# Altium schematic sheet RTC.SchDoc
size A4
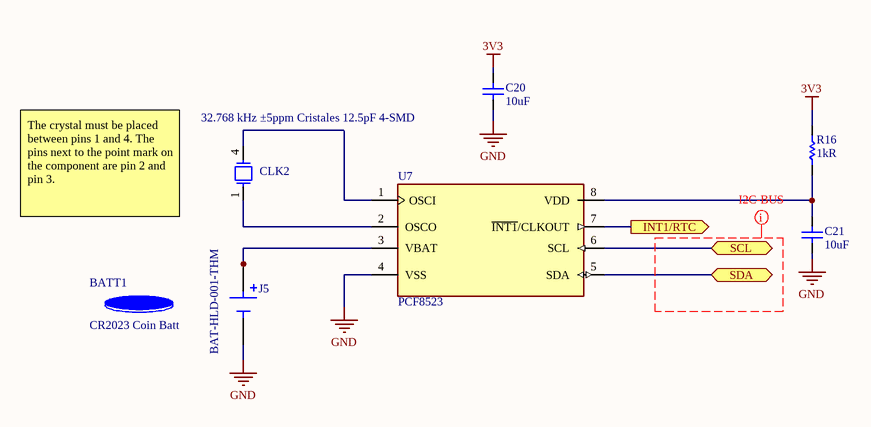
[diagram p0: RTC.SchDoc]

## Parts
BATT1  CR2023 Coin Batt  [CR2032 BATT]
C20  10uF  [Cap 0805 (2012 Metric)]
C21  10uF  [Cap 0805 (2012 Metric)]
CLK2  32.768 kHz ±5ppm Cristales 12.5pF 4-SMD  [Crystal32768]
J5  BAT-HLD-001-THM  [BAT-HLD-001-THM]
R16  1kR  [Res 0805 (2012 Metric)]
U7  PCF8523  [PCF8523]

## Ports
INT1/RTC (out), SCL (bidir), SDA (bidir)

## Nets
3V3: C20.1 R16.1
GND: C20.2 C21.2 J5.N U7.4(VSS)
INT1/RTC: U7.7(~{INT1}/CLKOUT) ; port INT1/RTC
SCL: U7.6(SCL) ; port SCL
SDA: U7.5(SDA) ; port SDA
NetC21_1: C21.1 R16.2 U7.8(VDD)
NetCLK2_1: CLK2.1 U7.2(OSCO)
NetCLK2_4: CLK2.4 U7.1(OSCI)
NetJ5_P1: J5.P1(P) J5.P2(P) J5.P3(P) J5.P4(P) U7.3(VBAT)

## Layout directives
net class I2C-BUS: (no net found under the mark)

## Notes on the sheet
- The crystal must be placed between pins 1 and 4. The pins next to the point mark on the component are pin 2 and pin 3.

## Library data of the parts
BATT1 = CR2023 Coin Batt: CR2032 Series Ø 20 mm 3V 225mAh Non-Rechargeable Lithium Coin Cell Battery; Manufacturer: Panasonic BSG; Number of Cells: 1; Battery Size: 2032; Battery Type: PRIMARY; Supplier 1: Mouser; RoHS: Yes; Category: Passive Components; Mount: External; Weight: 0.1oz; Material: Lithium; Min Operating Temperature: -30°C; Max Operating Temperature: 60°C; Package Quantity: 200; Capacity: 225mAh; Packaging: Tray; Series: CR2032; Chemistry/Technology: Lithium; Voltage Rating: 3V; Battery Chemistry: LITHIUM; Output Voltage: 3V; Voltage: 3V; Voltage Rating (DC): 3V; Diameter: 20mm; Height: 0.13inch; Radiation Hardening: No; Lead Free: Lead Free; RoHS Compliant: Yes; ComponentLink1URL: https://datasheet.ciiva.com/2/crseries-datasheets-merged-2903.pdf?src-supplier=Digi-Key; ComponentLink1Description: https://datasheet.ciiva.com/2/crseries-datasheets-merged-2903.pdf?src-supplier=Digi-Key; ComponentLink2URL: https://datasheet.ciiva.com/2981/aaa4000ce51-2981326.pdf?src-supplier=Avnet; ComponentLink2Description: https://datasheet.ciiva.com/2981/aaa4000ce51-2981326.pdf?src-supplier=Avnet; ComponentLink3URL: https://datasheet.ciiva.com/12070/crseries-datasheets-merged-462862-12070381.pdf?src-supplier=Mouser; ComponentLink3Description: https://datasheet.ciiva.com/12070/crseries-datasheets-merged-462862-12070381.pdf?src-supplier=Mouser; ComponentLink4URL: https://datasheet.ciiva.com/16459/aaa4000ce51-16459422.pdf?src-supplier=Avnet+Asia; ComponentLink4Description: https://datasheet.ciiva.com/16459/aaa4000ce51-16459422.pdf?src-supplier=Avnet+Asia; Pricing 1: 1=0,34000, 10=0,28100, 50=0,28100, 100=0,21700, 1000=0,19500, 10000=0,18100 (USD); Supplier Part Number 1: 658-CR2032; Manufacturer Part Number: CR2032; Link: https://www.digikey.com/es/products/detail/maxell-batteries/MAXELL-CR2032-TS-1/13283094
C20 C21 = Capacitor: CAP CER 10UF 10V X5R 0805; Manufacturer: KEMET; Manufacturer Part Number: C0805C106K8PACTU; Dielectric Material: Ceramic; Tolerance: 10%; Link: https://www.digikey.com/es/products/detail/kemet/C0805C106K8PACTU/1090830?s=N4IgTCBcDaIMIAYAcCCscCMCBsBpJACgIJwAqAqiALoC%2BQA; Supplier 1: Digi-Key; Supplier Part Number 1: 399-4925-1-ND; RoHS: Yes; Category: Ceramic Capacitors; Stock 1: 1166327; Pricing 1: 1=0,15000, 10=0,10600, 50=0,06040, 100=0,05000, 500=0,03508, 1000=0,02904 (USD); Mount: Surface Mount; Case/Package: 0805; Number of Pins: 2; Case Code (Imperial): 0805; Case Code (Metric): 2012; Contact Plating: Tin,Matte; Min Operating Temperature: -55°C; Max Operating Temperature: 85°C; Capacitance: 10uF; Packaging: Tape and Reel; Voltage Rating (DC): 10V; Termination: SMD/SMT; Package Quantity: 1; Voltage Rating: 10V; Voltage: 10V; Series: C; Dielectric: X5R; Construction: Flat; Dissipation Factor: 10%; Length: 2mm; Width: 1.2mm; Height: 1.25mm; Depth: 1.25mm; Thickness: 0.055inch; Radiation Hardening: No; REACH SVHC: No SVHC; RoHS Compliant: Yes; ComponentLink1URL: https://datasheet.ciiva.com/7842/1732709-7842198.pdf?src-supplier=Element14; ComponentLink1Description: https://datasheet.ciiva.com/7842/1732709-7842198.pdf?src-supplier=Element14; ComponentLink2URL: https://datasheet.ciiva.com/7842/40889-7842552.pdf?src-supplier=Element14; ComponentLink2Description: https://datasheet.ciiva.com/7842/40889-7842552.pdf?src-supplier=Element14; ComponentLink3URL: https://datasheet.ciiva.com/22704/1732709-22704859.pdf?src-supplier=Element14; ComponentLink3Description: https://datasheet.ciiva.com/22704/1732709-22704859.pdf?src-supplier=Element14
CLK2 = Crystal32768: 8.0x3.8 - 32.768KHz Quartz Xtal / Plastic, +/-5ppm @25C, 12.5pF; Manufacturer: QST; Manufacturer Part Number: QT2M-32.768KHZF-T; Supplier 1: Future Electronics; RoHS: No; Category: Uncategorized; Supplier Part Number 1: 9124852; Pricing 1: 3000=0,39500, 6000=0,31500 (USD); Link: https://www.digikey.com/es/products/detail/qst/QT2M-32-768KHZF-T/13418370
J5 = BAT-HLD-001-THM: BATTERY RETAINER COIN PC PIN; Manufacturer: Linx; Number of Cells: 1; Supplier 1: Digi-Key; RoHS: Yes; Category: Uncategorized; Stock 1: 22994; Mount: Through Hole,PCB; Package Quantity: 1000; Termination: PC Pin; Series: -; Packaging: Bulk; Lead Free: Lead Free; ComponentLink1URL: https://datasheet.ciiva.com/4/bat-hld-001-thm-4036.pdf?src-supplier=Digi-Key; ComponentLink1Description: https://datasheet.ciiva.com/4/bat-hld-001-thm-4036.pdf?src-supplier=Digi-Key; ComponentLink2URL: https://datasheet.ciiva.com/4642/bat-hld-001-thm20diagram-201675-4642582.pdf?src-supplier=Mouser; ComponentLink2Description: https://datasheet.ciiva.com/4642/bat-hld-001-thm20diagram-201675-4642582.pdf?src-supplier=Mouser; Pricing 1: 1=0,29000, 10=0,27800, 25=0,26600, 100=0,24100, 250=0,23200, 500=0,22200, 1000=0,20300, 2000=0,19000, 5000=0,17600 (USD); Manufacturer Part Number: BAT-HLD-001-THM; Supplier Part Number 1: BAT-HLD-001-THM-ND; Link: https://www.digikey.com/es/products/detail/linx-technologies-inc/BAT-HLD-001-THM/3044009?s=N4IgTCBcDaIEIEEAqBaAEgGQCIoAy4EYUk0BZEAXQF8g
R16 = Resistor: RES 1K OHM 1% 1/4W 0805; Manufacturer: Stackpole Electronics; Manufacturer Part Number: RNCP0805FTD1K00; Power Rating: 250mW; Temperature Coefficient: 100ppm/°C; Link: https://www.digikey.com/es/products/detail/stackpole-electronics-inc/RNCP0805FTD1K00/2240229?s=N4IgTCBcDaIEoDkDCAFADADjQVgGIBUARARgGk00QBdAXyA; Supplier 1: Digi-Key; Supplier Part Number 1: RNCP0805FTD1K00CT-ND; RoHS: Yes; Category: Chip SMD Resistors; Stock 1: 316834; Pricing 1: 1=0,10000, 10=0,07000, 100=0,02830, 1000=0,01272, 2500=0,01104 (USD); Mount: Surface Mount; Case/Package: 0805; Case Code (Metric): 2012; Case Code (Imperial): 0805; Size Code: 0805; Min Operating Temperature: -55°C; Max Operating Temperature: 155°C; Tolerance: 1%; Resistance: 1kR; Packaging: Tape and Reel; Resistor Type: Thin Film; Number of Terminations: 2; Max Power Dissipation: 250mW; Features: Moisture Resistant,Anti-Sulfur; Series: RNCP; Length: 0.079inch; Width: 0.049inch; Height: 0.024inch; Lead Free: Lead Free; RoHS Compliant: Yes; ComponentLink1URL: https://www.seielect.com/catalog/SEI-Packaging.pdf?src-supplier=Digi-Key; ComponentLink1Description: https://www.seielect.com/catalog/SEI-Packaging.pdf?src-supplier=Digi-Key; ComponentLink2URL: https://www.seielect.com/Catalog/SEI-rncp.pdf?src-supplier=Digi-Key; ComponentLink2Description: https://www.seielect.com/Catalog/SEI-rncp.pdf?src-supplier=Digi-Key; ComponentLink3URL: http://www.seielect.com/Catalog/SEI-rncp.pdf?src-supplier=Future+Electronics; ComponentLink3Description: http://www.seielect.com/Catalog/SEI-rncp.pdf?src-supplier=Future+Electronics
U7 = PCF8523: IC RTC CLK/CALENDAR I2C 8-SOIC; Manufacturer: NXP Semiconductors; Manufacturer Part Number: PCF8523T/1,118; Time Format: HH:MM:SS; Logic Function: Clock; Min Supply Voltage: 1.2V; Max Supply Voltage: 5.5V; Supplier 1: Avnet; RoHS: Yes; Category: Interface ICs; Mount: Surface Mount; Case/Package: SO; Number of Pins: 8; Contact Plating: Gold; Min Operating Temperature: -40°C; Max Operating Temperature: 85°C; Packaging: Tape and Reel; Interface: I2C; Package Quantity: 2500; Supply Voltage-Nom: 5.5V; Radiation Hardening: No; RoHS Compliant: Yes; REACH SVHC: No SVHC; Lead Free: Lead Free; Temperature Grade: INDUSTRIAL; ComponentLink1URL: https://datasheet.ciiva.com/1238/pcf8523-1238780.pdf?src-supplier=Digi-Key; ComponentLink1Description: https://datasheet.ciiva.com/1238/pcf8523-1238780.pdf?src-supplier=Digi-Key; ComponentLink2URL: https://datasheet.ciiva.com/1238/pcf8523-1238781.pdf?src-supplier=Digi-Key; ComponentLink2Description: https://datasheet.ciiva.com/1238/pcf8523-1238781.pdf?src-supplier=Digi-Key; ComponentLink3URL: https://datasheet.ciiva.com/1238/pcf8523-1238782.pdf?src-supplier=Digi-Key; ComponentLink3Description: https://datasheet.ciiva.com/1238/pcf8523-1238782.pdf?src-supplier=Digi-Key; ComponentLink4URL: https://datasheet.ciiva.com/15152/getdatasheetpartid-445247-15152839.pdf?src-supplier=Verical; ComponentLink4Description: https://datasheet.ciiva.com/15152/getdatasheetpartid-445247-15152839.pdf?src-supplier=Verical; ComponentLink5URL: https://datasheet.ciiva.com/16286/pcf8523-16286477.pdf?src-supplier=Future+Electronics; ComponentLink5Description: https://datasheet.ciiva.com/16286/pcf8523-16286477.pdf?src-supplier=Future+Electronics; Supplier Part Number 1: 52X6196; Pricing 1: 1=1,58000, 10=1,41000, 25=1,34000, 50=1,22000, 100=1,10000, 250=1,03000 (USD); Link: https://www.digikey.com/es/products/detail/nxp-usa-inc/PCF8523T-1-118/2530422